# EAGLE design czbd-rc-v0.11 - bk (EAGLE 6.6.0)
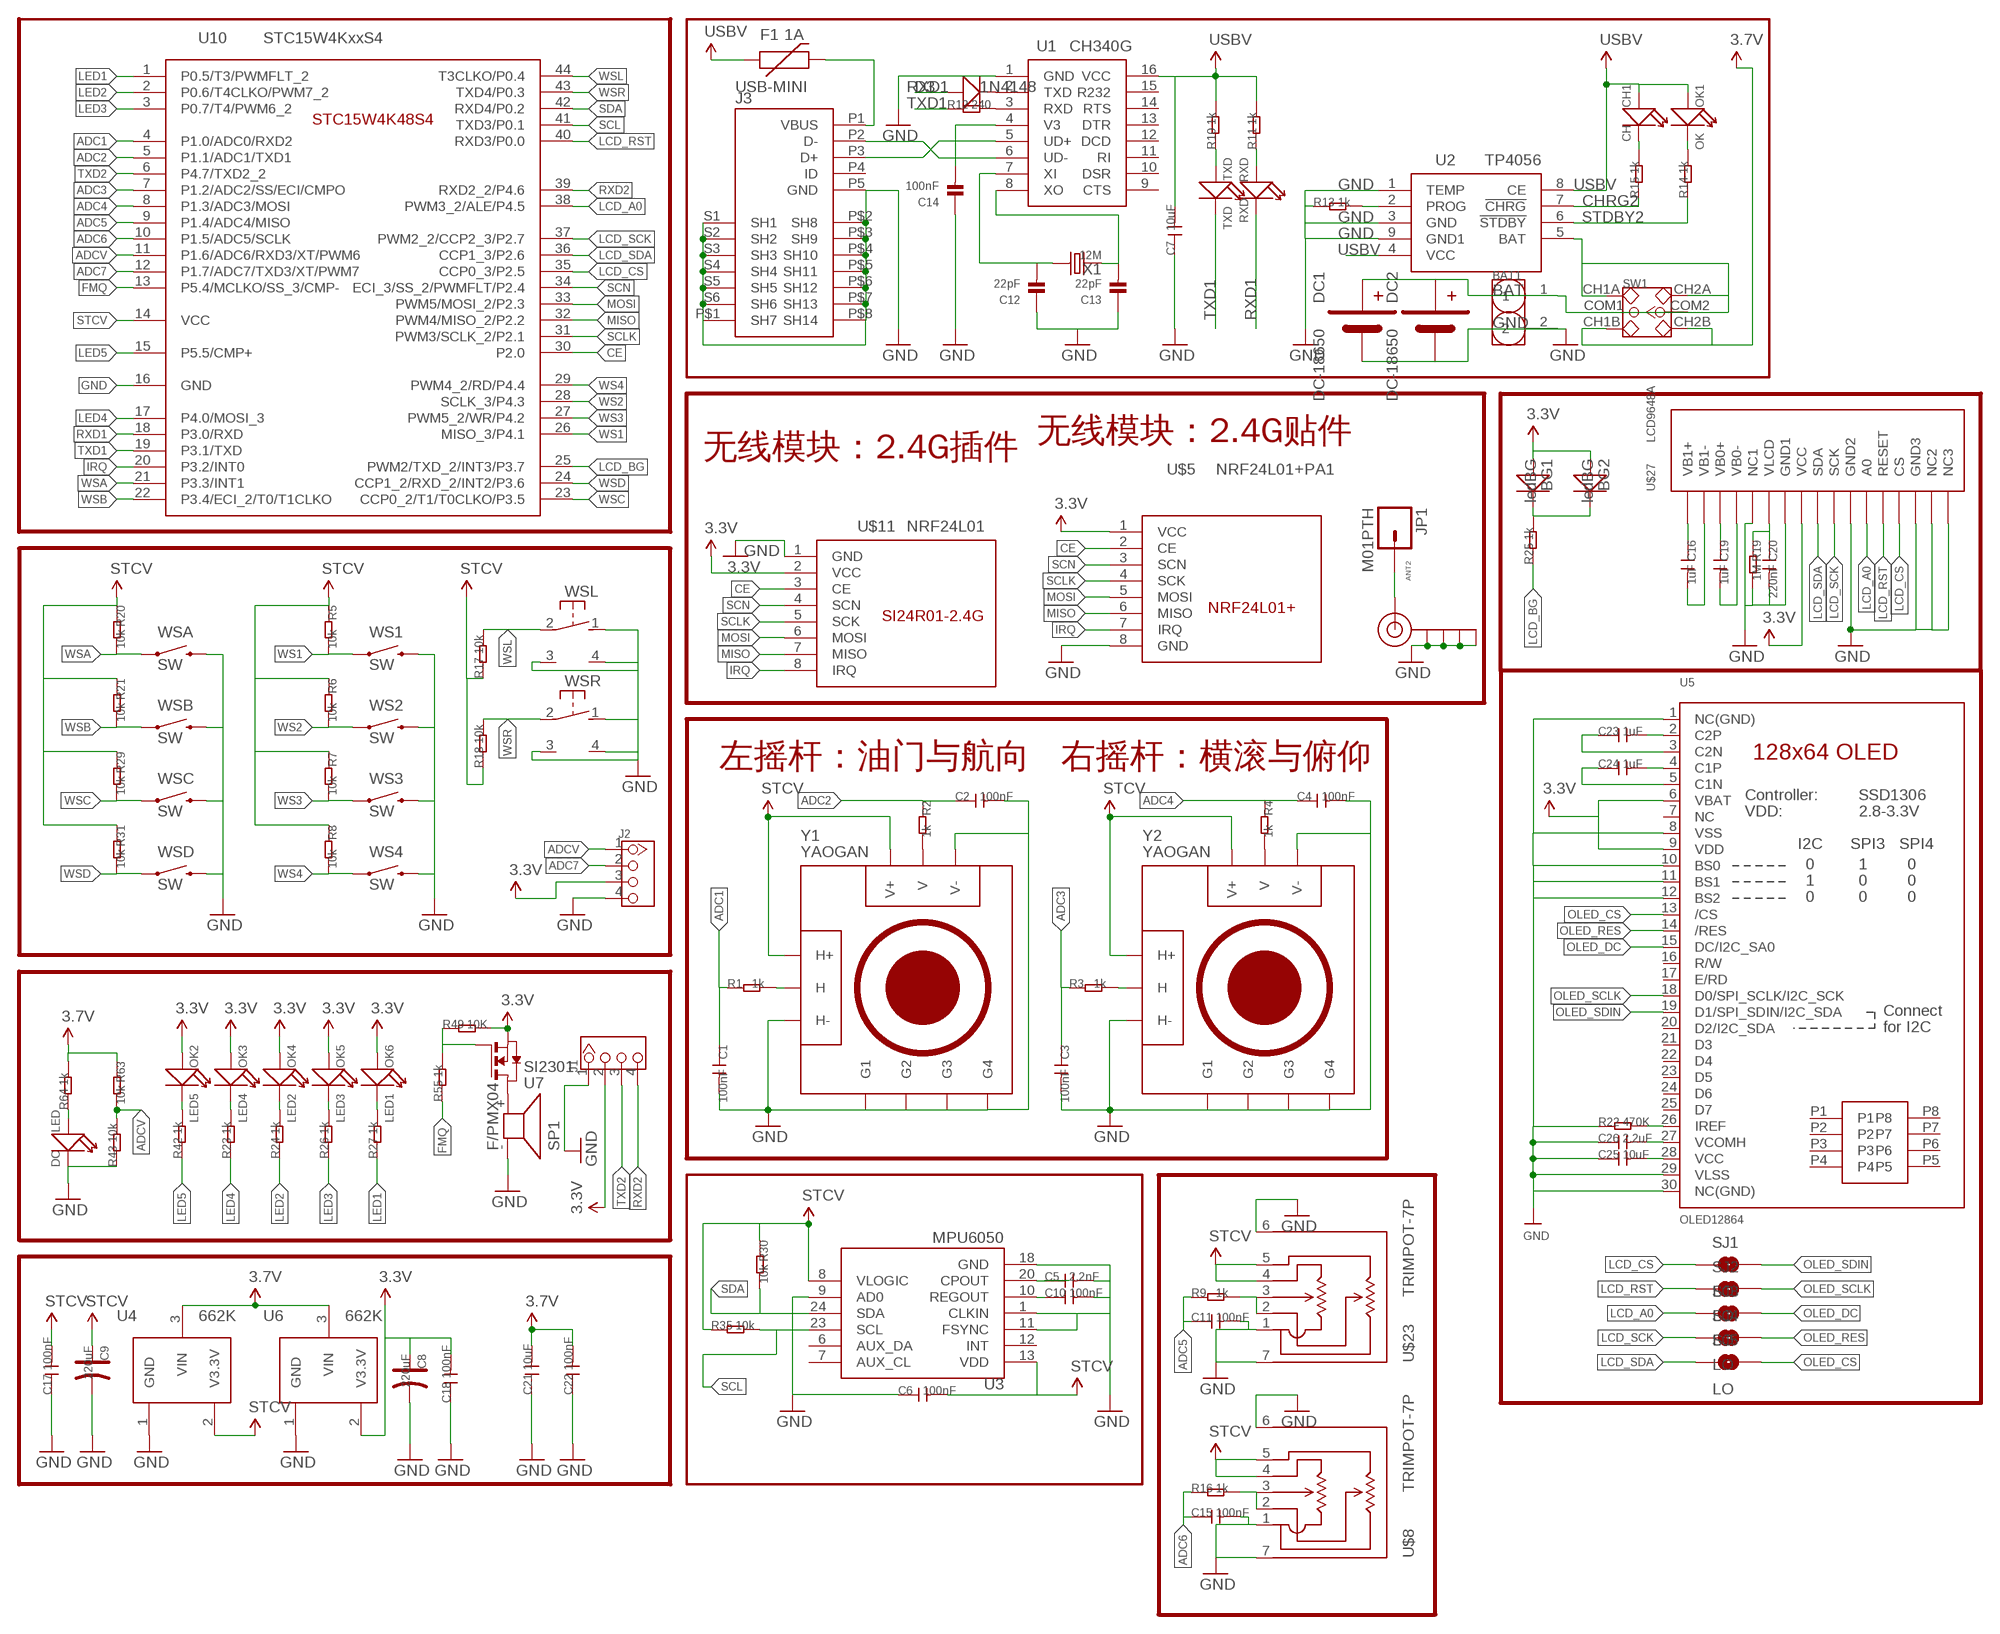
[diagram p0: schematic, sheet 1]

## Parts
ANT2  ANTENNA-SMA-EDGE  [3P-SMA-EDGE]
BAT1  HEADER-2P-2.54  [2P-2.54-DIP]
BG1  ledBG  D-1206  [D1206]
BG2  ledBG  D-1206  [D1206]
C1  100nF  DISCRETE_C-0603  [DISCRETE_C0603]
C2  100nF  DISCRETE_C-0603  [DISCRETE_C0603]
C3  100nF  DISCRETE_C-0603  [DISCRETE_C0603]
C4  100nF  DISCRETE_C-0603  [DISCRETE_C0603]
C5  2.2nF  DISCRETE_C-0603  [DISCRETE_C0603]
C6  100nF  DISCRETE_C-0603  [DISCRETE_C0603]
C7  10uF  DISCRETE_C-0805  [DISCRETE_C0805]
C8  220uF  CAP-D5.3/2.0  [ELECTRO-5.3MM]
C9  220uF  CAP-D5.3/2.0  [ELECTRO-5.3MM]
C10  100nF  DISCRETE_C-0603  [DISCRETE_C0603]
C11  100nF  DISCRETE_C-0603  [DISCRETE_C0603]
C12  22pF  CAP_CERAMIC0603  [0603]
C13  22pF  CAP_CERAMIC0603  [0603]
C14  100nF  CAP_CERAMIC0603  [0603]
C15  100nF  DISCRETE_C-0603  [DISCRETE_C0603]
C16  1uF  DISCRETE_C-0603  [DISCRETE_C0603]
C17  100nF  DISCRETE_C-0603  [DISCRETE_C0603]
C18  100nF  DISCRETE_C-0603  [DISCRETE_C0603]
C19  1uF  DISCRETE_C-0603  [DISCRETE_C0603]
C20  220nF  DISCRETE_C-0603  [DISCRETE_C0603]
C21  10uF  DISCRETE_C-0805  [DISCRETE_C0805]
C22  100nF  DISCRETE_C-0603  [DISCRETE_C0603]
C23  1uF  DISCRETE_C-0603  [DISCRETE_C0603]
C24  1uF  DISCRETE_C-0603  [DISCRETE_C0603]
C25  10uF  DISCRETE_C-0603  [DISCRETE_C0603]
C26  2.2uF  DISCRETE_C-0603  [DISCRETE_C0603]
CH1  CH  LED-0805  [D0805]
D3  1N4148  DISCRETE_D0805  [DISCRETE_SOD323]
DC1  DC-18650  DC18650B  [DC18650B]
DC2  DC-18650  DC18650B  [DC18650B]
F1  1A  PTCSMD  [PTC-1206]
J1  HEADER-4P-2.54  [4P-2.54-DIP]
J2  HEADER-4P-2.54  [4P-2.54-DIP]
J3  USB-MINI  [USB_MICRO]
JP1  M01PTH  [1X01]
LED  DC  LED-0805  [D0805]
OK1  OK  LED-0805  [D0805]
OK2  LED5  LED-0805  [D0805]
OK3  LED4  LED-0805  [D0805]
OK4  LED2  LED-0805  [D0805]
OK5  LED3  LED-0805  [D0805]
OK6  LED1  LED-0805  [D0805]
R1  1k  DISCRETE_R-0603  [DISCRETE_R0603]
R2  1k  DISCRETE_R-0603  [DISCRETE_R0603]
R3  1k  DISCRETE_R-0603  [DISCRETE_R0603]
R4  1k  DISCRETE_R-0603  [DISCRETE_R0603]
R5  10k  DISCRETE_R-0603  [DISCRETE_R0603]
R6  10k  DISCRETE_R-0603  [DISCRETE_R0603]
R7  10k  DISCRETE_R-0603  [DISCRETE_R0603]
R8  10k  DISCRETE_R-0603  [DISCRETE_R0603]
R9  1k  DISCRETE_R-0603  [DISCRETE_R0603]
R10  1k  R-0603  [R0603]
R11  1k  R-0603  [R0603]
R12  240  R-0603  [R0603]
R13  1k  R-0603  [R0603]
R14  1k  R-0603  [R0603]
R15  1k  R-0603  [R0603]
R16  1k  DISCRETE_R-0603  [DISCRETE_R0603]
R17  10k  DISCRETE_R-0603  [DISCRETE_R0603]
R18  10k  DISCRETE_R-0603  [DISCRETE_R0603]
R19  1M  DISCRETE_R-0603  [DISCRETE_R0603]
R20  10k  DISCRETE_R-0603  [DISCRETE_R0603]
R21  10k  DISCRETE_R-0603  [DISCRETE_R0603]
R22  470K  DISCRETE_R-0603  [DISCRETE_R0603]
R23  1k  R-0603  [R0603]
R24  1k  R-0603  [R0603]
R25  1k  R-0603  [R0603]
R26  1k  R-0603  [R0603]
R27  1k  R-0603  [R0603]
R29  10k  DISCRETE_R-0603  [DISCRETE_R0603]
R30  10k  DISCRETE_R-0603  [DISCRETE_R0603]
R31  10k  DISCRETE_R-0603  [DISCRETE_R0603]
R35  10k  DISCRETE_R-0603  [DISCRETE_R0603]
R42  1k  R-0603  [R0603]
R43  10k  R-0603  [R0603]
R49  10K  R-0603  [R0603]
R55  1k  R-0603  [R0603]
R63  10k  R-0603  [R0603]
R64  1k  R-0603  [R0603]
RXD  RXD  LED-0805  [D0805]
SJ1  LO  SPARKFUN_SOLDERJUMPERTRACE  [SPARKFUN_SJ_2S-TRACE]
SJ2  LO  SPARKFUN_SOLDERJUMPERTRACE  [SPARKFUN_SJ_2S-TRACE]
SJ3  LO  SPARKFUN_SOLDERJUMPERTRACE  [SPARKFUN_SJ_2S-TRACE]
SJ4  LO  SPARKFUN_SOLDERJUMPERTRACE  [SPARKFUN_SJ_2S-TRACE]
SJ5  LO  SPARKFUN_SOLDERJUMPERTRACE  [SPARKFUN_SJ_2S-TRACE]
SP1  F/PMX04  [F/PMX04A]
SW1  SEEEDSTUDIO-DISCRETE.RPT_SWITCH-2CH-6P  [SEEEDSTUDIO-DISCRETE.RPT_6P-2CH-2.54-7.6X3.0]
TXD  TXD  LED-0805  [D0805]
U1  CH340G  CH340GSO  [SO16]
U2  TP4056  [SOP8+1]
U3  MPU6050  TESTING_MPU-6050-1  [TESTING_QFN-24-4MM2]
U4  662K  XC6206P332MR662K  [SOT23-3]
U5  OLED12864  DISP_OLED_UG-2864HSWEG010.96"  [UG-2864HSWEG01_0.96IN_WRAPAROUND]
U6  662K  XC6206P332MR662K  [SOT23-3]
U7  SI2301  ARDUINO-QXZ_SI2302  [ARDUINO-QXZ_SI2301]
U8  OLED-TK  [OLED-0.96C-TK]
U10  STC15W4KxxS4  STC15W4K48S4-44P  [LQFP44]
U$5  NRF24L01+PA1  [NRF24L01+PA-C]
U$8  TRIMPOT-7P  [TO-5P]
U$11  NRF24L01  SI24R011  [SI24R01-B]
U$23  TRIMPOT-7P  [TO-5P]
U$27  LCD9648A  [LCD96X48]
WS1  SW  SWITCH-2P-SMD-1101NE  [TACTILE-SWITCH-1101NE]
WS2  SW  SWITCH-2P-SMD-1101NE  [TACTILE-SWITCH-1101NE]
WS3  SW  SWITCH-2P-SMD-1101NE  [TACTILE-SWITCH-1101NE]
WS4  SW  SWITCH-2P-SMD-1101NE  [TACTILE-SWITCH-1101NE]
WSA  SW  SWITCH-2P-SMD-1101NE  [TACTILE-SWITCH-1101NE]
WSB  SW  SWITCH-2P-SMD-1101NE  [TACTILE-SWITCH-1101NE]
WSC  SW  SWITCH-2P-SMD-1101NE  [TACTILE-SWITCH-1101NE]
WSD  SW  SWITCH-2P-SMD-1101NE  [TACTILE-SWITCH-1101NE]
WSL  SWITCH-4PS  [B3F-31XX]
WSR  SWITCH-4PS  [B3F-31XX]
X1  12M  CRYSTAL-TC26H  [TC26H]
Y1  YAOGAN  [YAOGAN5K]
Y2  YAOGAN  [YAOGAN5K]

## Nets
3.3V: BG1.+ BG2.+ C8.+ C18.2 J1.2 J2.3 OK2.+ OK3.+ OK4.+ OK5.+ OK6.+ R49.2 U5.6(VBAT) U5.9(VDD) U6.2(V3.3V) U7.2(S) U$5.1(VCC) U$11.2(VCC) U$27.P8(VCC)
3.7V: C21.2 C22.2 R63.1 R64.2 SW1.CH1B SW1.CH2B U4.3(VIN) U6.3(VIN)
ADC1: C1.1 R1.1 U10.4(P1.0/ADC0/RXD2)
ADC2: C2.1 R2.1 U10.5(P1.1/ADC1/TXD1)
ADC3: C3.1 R3.1 U10.7(P1.2/ADC2/SS/ECI/CMPO)
ADC4: C4.1 R4.1 U10.8(P1.3/ADC3/MOSI)
ADC5: C11.1 R9.1 U10.9(P1.4/ADC4/MISO)
ADC6: C15.1 R16.1 U10.10(P1.5/ADC5/SCLK)
ADC7: J2.2 U10.12(P1.7/ADC7/TXD3/XT/PWM7)
ADCV: J2.1 R43.2 R63.2 U10.11(P1.6/ADC6/RXD3/XT/PWM6)
BAT: BAT1.1 DC1.+ DC2.+ SW1.CH1A SW1.CH2A SW1.COM1 SW1.COM2 U2.5(BAT)
CE: U10.30(P2.0) U$5.2(CE) U$11.3(CE)
CHRG2: R15.1 U2.7(!CHRG)
FMQ: R55.1 U10.13(P5.4/MCLKO/SS_3/CMP-)
GND: ANT2.GND@0(GND) ANT2.GND@1(GND) ANT2.GND@2(GND) ANT2.GND@3(GND) BAT1.2 C1.2 C2.2 C3.2 C4.2 C5.2 C6.1 C7.1 C8.- C9.- C10.2 C11.2 C12.1 C13.1 C14.1 C15.2 C17.1 C18.1 C20.2 C21.1 C22.1 C25.1 C26.1 DC1.- DC2.- J1.1 J2.4 J3.P5(GND) J3.P$1(SH7) J3.P$2(SH8) J3.P$3(SH9) J3.P$4(SH10) J3.P$5(SH11) J3.P$6(SH12) J3.P$7(SH13) J3.P$8(SH14) J3.S1(SH1) J3.S2(SH2) J3.S3(SH3) J3.S4(SH4) J3.S5(SH5) J3.S6(SH6) LED.- R13.1 R19.2 R22.1 R43.1 SP1.- U1.1(GND) U2.1(TEMP) U2.3(GND) U2.9(GND1) U3.1(CLKIN) U3.9(AD0) U3.11(FSYNC) U3.18(GND) U4.1(GND) U5.1(NC(GND)) U5.8(VSS) U5.10(BS0) U5.11(BS1) U5.12(BS2) U5.29(VLSS) U5.30(NC(GND)) U6.1(GND) U10.16(GND) U$5.8(GND) U$8.1(L) U$8.6(G1) U$8.7(G2) U$11.1(GND) U$23.1(L) U$23.6(G1) U$23.7(G2) U$27.P5(NC1) U$27.P7(GND1) U$27.P11(GND2) U$27.P15(GND3) U$27.P16(NC2) U$27.P17(NC3) WS1.P$2 WS2.P$2 WS3.P$2 WS4.P$2 WSA.P$2 WSB.P$2 WSC.P$2 WSD.P$2 WSL.1(S) WSL.3(G2) WSL.4(G1) WSR.1(S) WSR.3(G2) WSR.4(G1) Y1.H3(H-) Y1.MOUNT1(G1) Y1.MOUNT2(G2) Y1.MOUNT3(G3) Y1.MOUNT4(G4) Y1.V3(V-) Y2.H3(H-) Y2.MOUNT1(G1) Y2.MOUNT2(G2) Y2.MOUNT3(G3) Y2.MOUNT4(G4) Y2.V3(V-)
IRQ: U10.20(P3.2/INT0) U$5.7(IRQ) U$11.8(IRQ)
LCD_A0: SJ3.1 U10.38(PWM3_2/ALE/P4.5) U$27.P12(A0)
LCD_BG: R25.1 U10.25(PWM2/TXD_2/INT3/P3.7)
LCD_CS: SJ1.1 U10.35(CCP0_3/P2.5) U$27.P14(CS)
LCD_RST: SJ2.1 U10.40(RXD3/P0.0) U$27.P13(RESET)
LCD_SCK: SJ4.1 U10.37(PWM2_2/CCP2_3/P2.7) U$27.P10(SCK)
LCD_SDA: SJ5.1 U10.36(CCP1_3/P2.6) U$27.P9(SDA)
LED1: R27.1 U10.1(P0.5/T3/PWMFLT_2)
LED2: R24.1 U10.2(P0.6/T4CLKO/PWM7_2)
LED3: R26.1 U10.3(P0.7/T4/PWM6_2)
LED4: R23.1 U10.17(P4.0/MOSI_3)
LED5: R42.1 U10.15(P5.5/CMP+)
MISO: U10.32(PWM4/MISO_2/P2.2) U$5.6(MISO) U$11.7(MISO)
MOSI: U10.33(PWM5/MOSI_2/P2.3) U$5.5(MOSI) U$11.6(MOSI)
N$1: R1.2 Y1.H2(H)
N$2: R3.2 Y2.H2(H)
N$3: R4.2 Y2.V2(V)
N$4: R2.2 Y1.V2(V)
N$5: R9.2 U$23.2(W2) U$23.3(W1)
N$6: R16.2 U$8.2(W2) U$8.3(W1)
N$7: C16.1 U$27.P1(VB1+)
N$8: C16.2 U$27.P2(VB1-)
N$9: C19.1 U$27.P3(VB0+)
N$10: C19.2 U$27.P4(VB0-)
N$11: C20.1 R19.1 U$27.P6(VLCD)
N$12: OK3.- R23.2
N$13: OK4.- R24.2
N$14: R22.2 U5.26(IREF)
N$15: CH1.- R15.2
N$16: C10.1 U3.10(REGOUT)
N$17: C5.1 U3.20(CPOUT)
N$18: C23.2 U5.2(C2P)
N$19: C23.1 U5.3(C2N)
N$20: OK6.- R27.2
N$21: ANT2.SIG(SIGNAL) JP1.1
N$22: R13.2 U2.2(PROG)
N$23: SP1.+ U7.1(D)
N$24: C24.2 U5.4(C1P)
N$25: C24.1 U5.5(C1N)
N$26: OK2.- R42.2
N$27: C25.2 U5.28(VCC)
N$28: D3.- U1.2(TXD)
N$29: C26.2 U5.27(VCOMH)
N$30: BG1.- BG2.- R25.2
N$31: OK5.- R26.2
N$38: R10.1 TXD.+
N$39: R49.1 R55.2 U7.3(G)
N$41: R11.1 RXD.+
N$42: C13.2 U1.8(XO) X1.1
N$43: C12.2 U1.7(XI) X1.2
N$47: F1.2 J3.P1(VBUS)
N$48: C14.2 U1.4(V3)
N$53: R12.2 U1.3(RXD)
N$54: J3.P2(D-) U1.6(UD-)
N$55: J3.P3(D+) U1.5(UD+)
N$65: LED.+ R64.1
N$321: OK1.- R14.2
OLED_CS: SJ5.2 U5.13(/CS)
OLED_DC: SJ3.2 U5.15(DC/I2C_SA0)
OLED_RES: SJ4.2 U5.14(/RES)
OLED_SCLK: SJ2.2 U5.18(D0/SPI_SCLK/I2C_SCK)
OLED_SDIN: SJ1.2 U5.19(D1/SPI_SDIN/I2C_SDA)
RXD1: D3.+ RXD.- U10.18(P3.0/RXD)
RXD2: J1.4 U10.39(RXD2_2/P4.6)
SCL: R35.2 U3.23(SCL) U10.41(TXD3/P0.1)
SCLK: U10.31(PWM3/SCLK_2/P2.1) U$5.4(SCK) U$11.5(SCK)
SCN: U10.34(ECI_3/SS_2/PWMFLT/P2.4) U$5.3(SCN) U$11.4(SCN)
SDA: R30.2 U3.24(SDA) U10.42(RXD4/P0.2)
STCV: C6.2 C9.+ C17.2 R5.1 R6.1 R7.1 R8.1 R17.1 R18.1 R20.1 R21.1 R29.1 R30.1 R31.1 R35.1 U3.8(VLOGIC) U3.13(VDD) U4.2(V3.3V) U10.14(VCC) U$8.4(H1) U$8.5(H2) U$23.4(H1) U$23.5(H2) Y1.H1(H+) Y1.V1(V+) Y2.H1(H+) Y2.V1(V+)
STDBY2: R14.1 U2.6(!STDBY)
TXD1: R12.1 TXD.- U10.19(P3.1/TXD)
TXD2: J1.3 U10.6(P4.7/TXD2_2)
USBV: C7.2 CH1.+ F1.1 OK1.+ R10.2 R11.2 U1.16(VCC) U2.4(VCC) U2.8(CE)
WS1: R5.2 U10.26(MISO_3/P4.1) WS1.P$1
WS2: R6.2 U10.28(SCLK_3/P4.3) WS2.P$1
WS3: R7.2 U10.27(PWM5_2/WR/P4.2) WS3.P$1
WS4: R8.2 U10.29(PWM4_2/RD/P4.4) WS4.P$1
WSA: R20.2 U10.21(P3.3/INT1) WSA.P$1
WSB: R21.2 U10.22(P3.4/ECI_2/T0/T1CLKO) WSB.P$1
WSC: R29.2 U10.23(CCP0_2/T1/T0CLKO/P3.5) WSC.P$1
WSD: R31.2 U10.24(CCP1_2/RXD_2/INT2/P3.6) WSD.P$1
WSL: R17.2 U10.44(T3CLKO/P0.4) WSL.2(P)
WSR: R18.2 U10.43(TXD4/P0.3) WSR.2(P)
Unconnected: J3.P4(ID) U1.9(CTS) U1.10(DSR) U1.11(RI) U1.12(DCD) U1.13(DTR) U1.14(RTS) U1.15(R232) U3.6(AUX_DA) U3.7(AUX_CL) U3.12(INT) U5.7(NC) U5.16(R/W) U5.17(E/RD) U5.20(D2/I2C_SDA) U5.21(D3) U5.22(D4) U5.23(D5) U5.24(D6) U5.25(D7) U8.P1 U8.P2 U8.P3 U8.P4 U8.P5 U8.P6 U8.P7 U8.P8

## Notes on the sheet
- 无线模块：2.4G贴件
- 无线模块：2.4G插件
- 左摇杆：油门与航向 | 右摇杆：横滚与俯仰

## Library data of the parts
ANT2 = SeeedStudio-Connector:ANTENNA-SMA-EDGE: SMA Antenna Connector End launch SMA connector. The paste layer has been removed so that the connector can be hand soldered onto the board after reflow.
BAT1 = SeeedStudio-Connector:HEADER-2P
BG1 BG2 = Seeedstudio-Discrete.rpt:D*
C1-C7 C10 C11 C15-C26 = mazebot:DISCRETE_C*: Ceramic Capacitors
C8 C9 = Seeedstudio-Discrete.rpt:CAP*: Electrolytic Capacitors,Tantalum Capacitors and Super Capacitors
C12-C14 = microbuilder:CAP_CERAMIC: Ceramic Capacitors 0402 - 0402 Surface Mount Capacitors 16pF 50V 5% [Digikey: 445-4899-2-ND] 18pF 50V 5% [Digikey: 490-1281-2-ND] 22pF 50V 5% [Digikey: 490-1283-2-ND] 68pF 50V 5% [Digikey: 490-1289-2-ND] 0.1uF 10V 10% [Digikey: 490-1318-2-ND] 1.0uF 6.3V 10% [Digikey: 490-1320-2-ND] 0603 - 0603 Surface Mount Capacitors 16 pF 50V 5% [Digikey: 445-5051-2-ND] 22 pF 50V [Digikey: PCC220ACVTR-ND] 33 pF 50V 5% [Digikey: 490-1415-1-ND] 56pF 50V 5% [Digikey: 490-1421-1-ND] 220pF 50V 5% [Digikey: 445-1285-1-ND] 680 pF 50V 2200 pF 50V 5% C0G [Digikey: 445-1297-1-ND] 5600 pF 100V 5% X7R [Digikey: 478-3711-1-ND] 0.1 µF 25V 10% [Digikey: PCC2277TR-ND] 0.22 µF 16V 10% X7R [Digikey: 445-1318-1-ND] 1.0 µF 25V 10% [Digikey: 445-5146-2-ND] 0603 - RF Specific 3pF 250V +/-0.1pF RF [Digikey: 712-1347-1-ND] 18 pF 250V 5% [Digikey: 478-3505-1-ND or 712-1322-1-ND] 56 pF 250V 5% C0G RF [Digikey: 490-4867-1-ND] 68 pF 250V RF [Digikey: 490-4868-1-ND] 0805 - 0805 Surface Mount Capacitors 220 pF 250V 2% RF Ceramic Capacitor [Digikey: 712-1398-1-ND] 1000 pF 50V 2% NP0 Ceramic Capacitor [Digikey: 478-3760-1-ND] 0.1 µF 25V 10% Ceramic Capacitor [Digikey: PCC1828TR-ND] 1.0 µF 16V 10% Ceramic Capacitor[Digikey: 490-1691-2-ND] 10.0 µF 10V 10% Ceramic Capacitor[Digikey: 709-1228-1-ND] 10.0 uF 16V 10% Ceramic Capacitor [Digikey: 478-5165-2-ND] 47 uF 6.3V 20% Ceramic Capacitor [Digikey: 587-1779-1-ND or 399-5506-1-ND] 1206 - 1206 Surface Mount Capacitors 47uF 10V 20% Ceramic Capacitor [Digikey: 490-5528-1-ND or 399-5508-1-ND or 445-6010-1-ND] 100uF 6.3V -20%, +80% Y5V Ceramic Capacitor (Digikey: 490-4512-1-ND, Mouser: 81-GRM31CF50J107ZE1L)
CH1 LED OK1-OK6 RXD TXD = Discrete:LED*
D3 = mazebot:DISCRETE_D*
DC1 DC2 = QXZ:DC18650
F1 = SparkFun-PowerIC:PTC: Resettable Fuse PTC Resettable Fuse. Spark Fun Electronics SKU : COM-08357
J1 J2 = SeeedStudio-Connector:HEADER-4P
J3 = QXZ:USB-MINI
JP1 = QXZ:M01: Header 1 Standard 1-pin 0.1" header. Use with straight break away headers (SKU : PRT-00116), right angle break away headers (PRT-00553), swiss pins (PRT-00743), machine pins (PRT-00117), and female headers (PRT-00115).
R1-R9 R16-R22 R29-R31 R35 = mazebot:DISCRETE_R*
R10-R15 R23-R27 R42 R43 R49 R55 R63 R64 = Discrete:R*
SJ1-SJ5 = mazebot:SPARKFUN_SOLDERJUMPER: Solder Jumper Standard SMD solder jumper. Used to automate production. Two varients : Normally Open and Normally Closed are the same, but have different paste layers. NC will have a large amount of paste and should jumper during reflow.
SP1 = arduino-QXZ:F/PMX04: SPEAKER Source: Buerklin; OC_FARNELL: unknown; OC_NEWARK: unknown
SW1 = mazebot:SEEEDSTUDIO-DISCRETE.RPT_SWITCH-2CH-6P
U1 = QXZ:CH340G
U2 = QXZ:TP4056
U3 = MPU6050:TESTING_MPU-6050
U4 U6 = QXZ:XC6206P332MR
U5 = microbuilder:DISP_OLED_UG-2864HSWEG01: UG-2864HSWEG01 OLED display Both 1.3" and 0.96" models share the same FPC tab footprint, only the screen dimensions vary.
U7 = mazebot:ARDUINO-QXZ_SI2302
U8 = duinofun-outline:OLED-TK
U10 = QXZ:STC15W4K48S4-44P
U$5 = QXZ:NRF24L01+
U$8 U$23 = QXZ:TRIMPOT-7P
U$11 = QXZ:SI24R01
U$27 = QXZ:LCD9648
WS1-WS4 WSA WSB WSC WSD = QXZ:SWITCH-2P
WSL WSR = QXZ:SWITCH-4PS: OMRON SWITCH Now with beefier pads!
X1 = Seeedstudio-Discrete.rpt:CRYSTAL*: CRYSTAL
Y1 Y2 = QXZ:YAOGAN

## Net classes
0 default: width 0.203 mm, drill 0.305 mm, clearance 0.203 mm

## Board
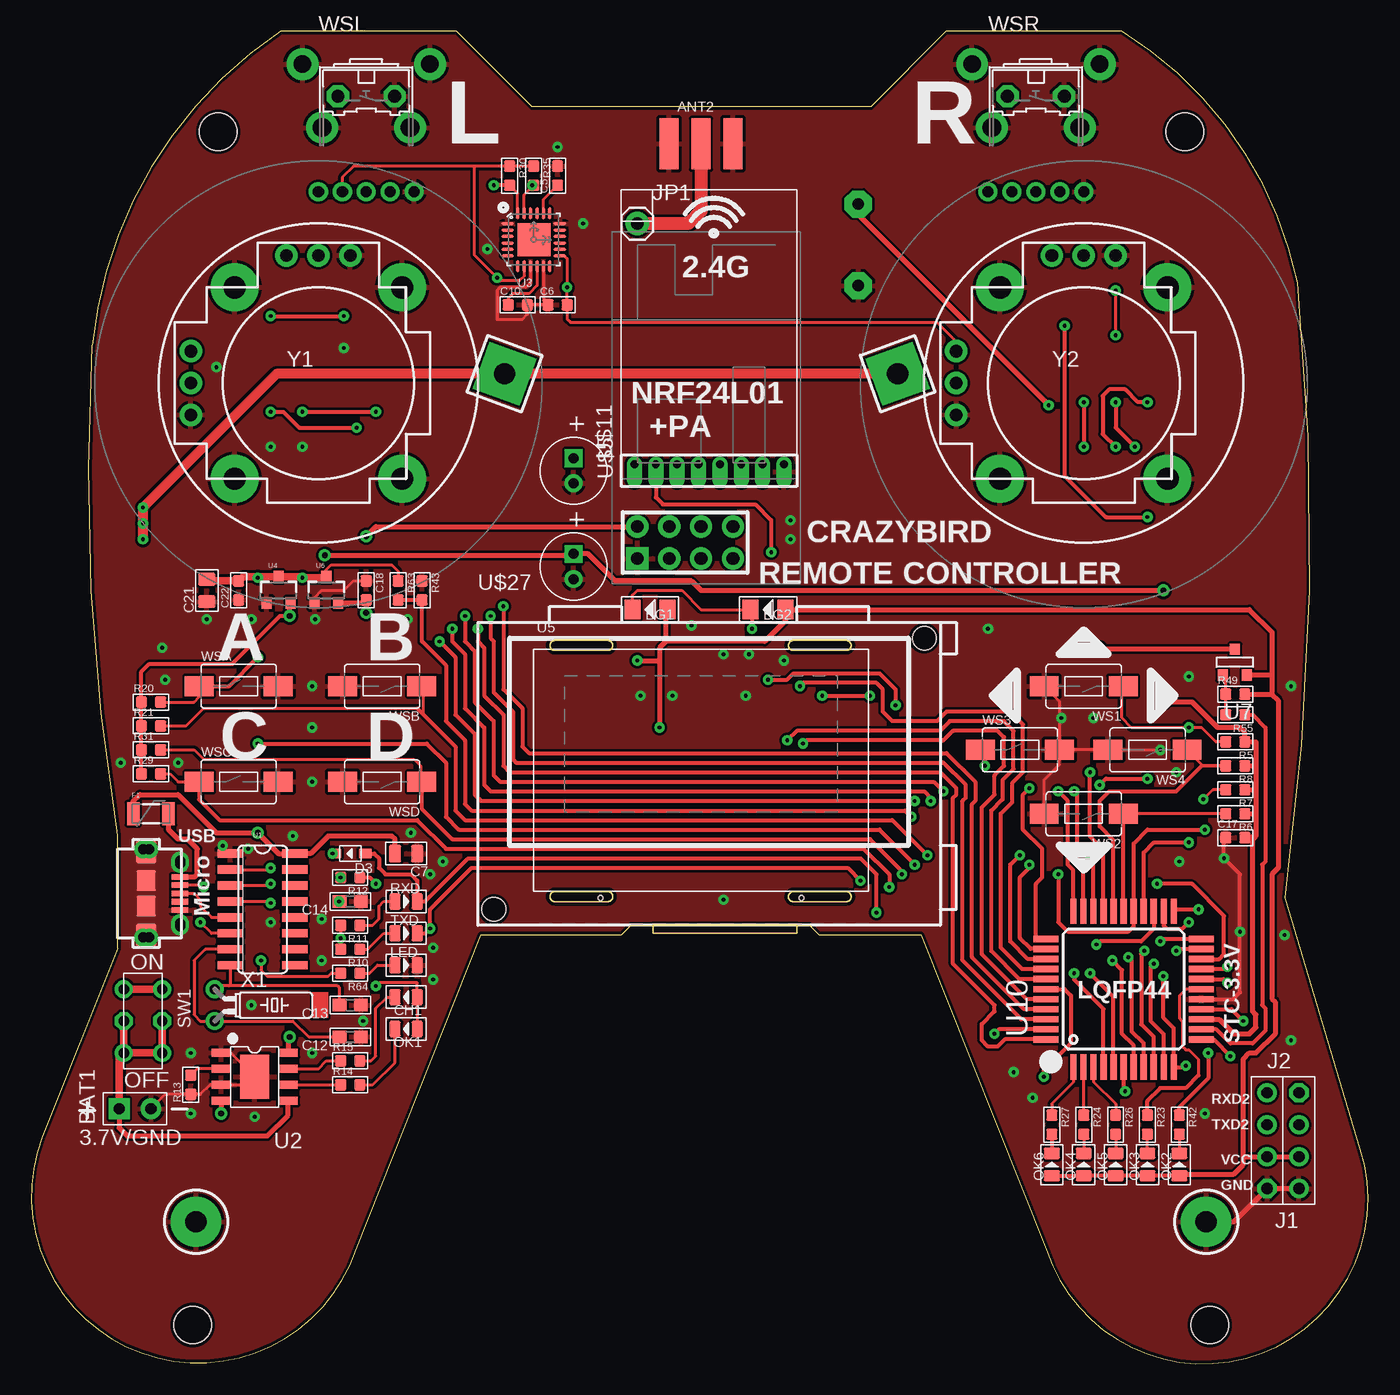
[diagram p1: board, top side]
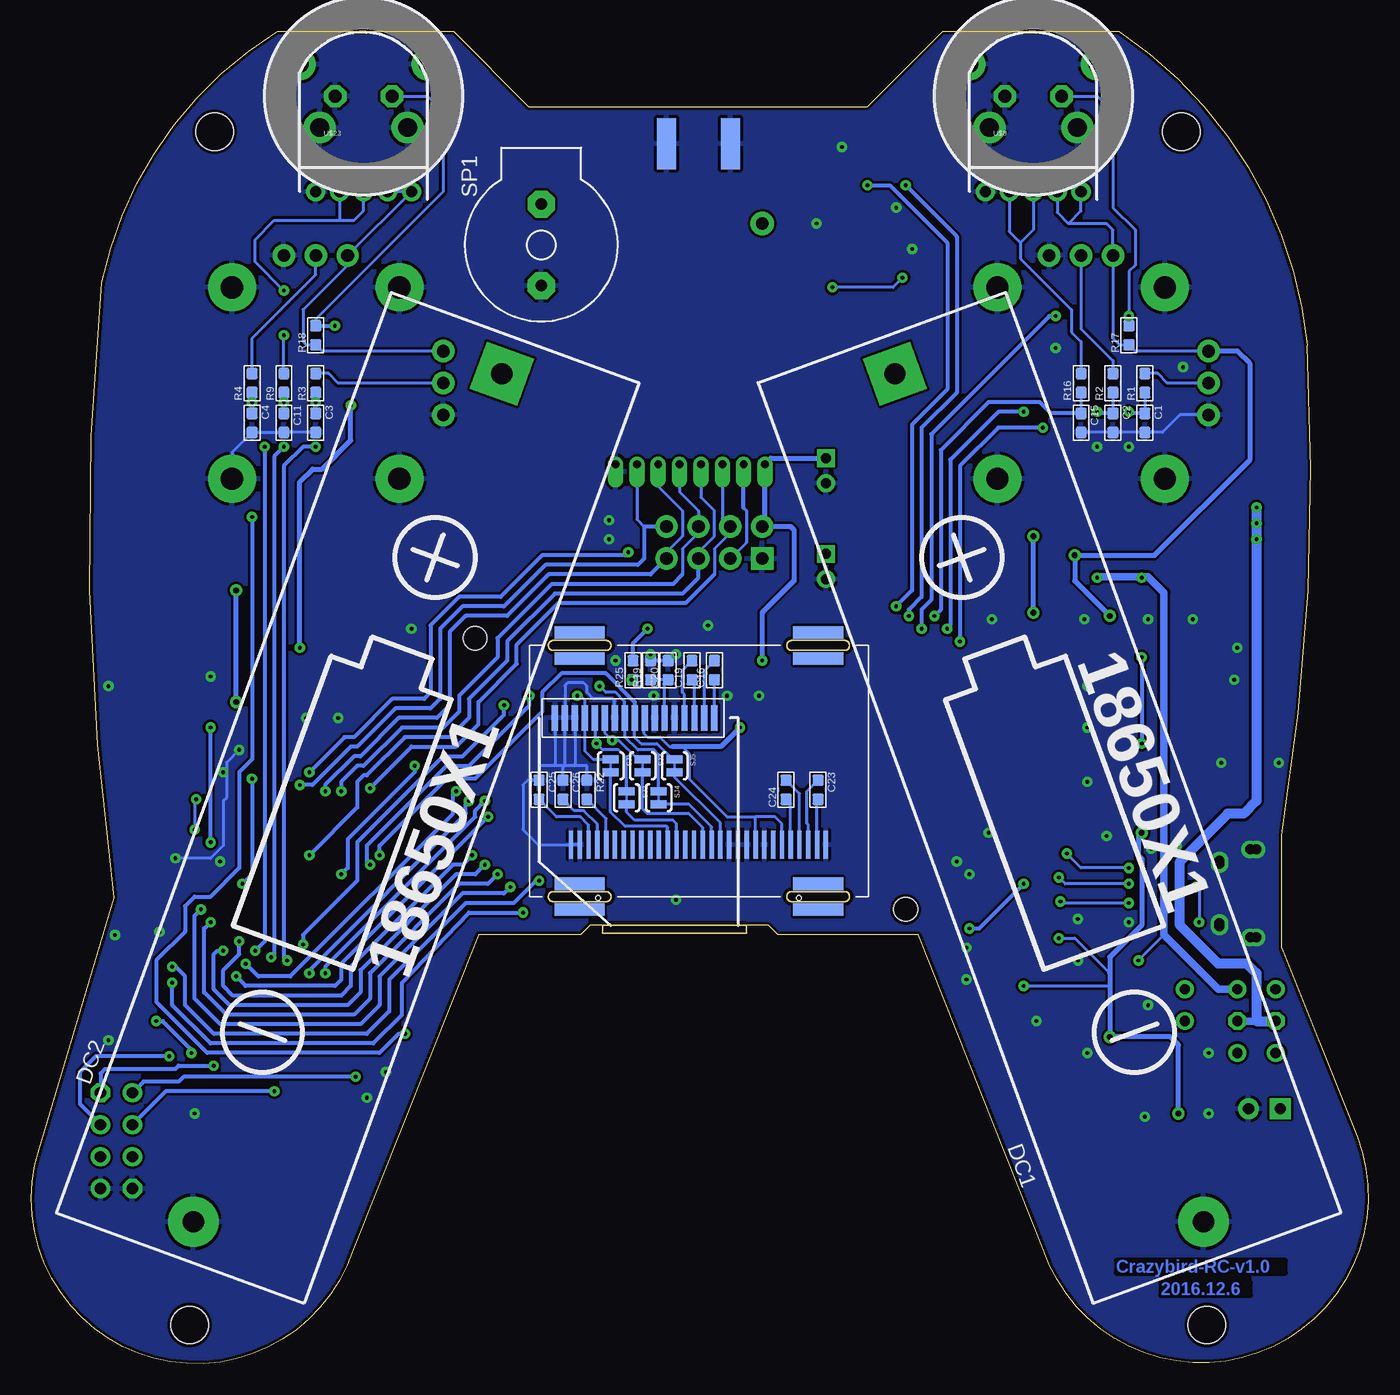
[diagram p2: board, bottom side, seen from below]

Size 106.47 x 106.07 mm. Coordinates in mm from the lower left corner, seen from the top.
Outline: 19.86,106.07 arc51 4.86,81.07 arc13 6.86,42.07 6.86,33.07 0.86,18.07 arc182 25.86,9.07 35.82,34.13 46.99,34.13 47.75,34.89 61.98,34.89 62.74,34.13 70.87,34.13 80.86,9.07 arc180 105.86,17.07 99.86,37.07 arc14 100.86,86.07 arc46 86.86,106.07 72.86,106.07 66.86,100.07 39.86,100.07 33.86,106.07 19.86,106.07
Copper layers (1*16): Top 0.035mm / dielectric 1.5mm / Bottom 0.035mm
Design rules "Sparkfun": minimum track width 8mil, minimum drill 20mil, track to track 8mil, track to pad 8mil, pad to pad 8mil, via to via 8mil, smd to smd 8mil, copper to edge 10mil, drill to drill 8mil, minimum pad ring 12mil, minimum via ring 10mil, stop-mask expansion 4mil, vias tented up to drill 25mil, thermal gap 10mil
Holes 3 mm at 14.86,98.07 91.86,98.07 93.86,3.07 12.86,3.07

### Footprints (pad centres in the part's own frame; a part is rotated, then mirrored left to right if it is on the bottom)
3P-SMA-EDGE = smd 1.524 x 4.064: GND@0 0,0; GND@1 5.08,0; SIG 2.54,0 | smd 1.524 x 4.064 bottom: GND@2 0,0; GND@3 5.08,0
2P-2.54-DIP = drill 0.889 pad 1.651 square: 1 0,1.27 | drill 0.889 pad 1.651: 2 0,-1.27
D1206 = smd 1.27 x 1.524: + -1.397,0; - 1.397,0
DISCRETE_C0603 = smd 0.889 x 0.889: 1 -0.762,0; 2 0.762,0
DISCRETE_C0805 = smd 1.016 x 1.397: 1 -0.889,0; 2 0.889,0
ELECTRO-5.3MM = drill 0.8 pad 1.35 square: + -1,0 | drill 0.8 pad 1.35: - 1,0
0603 = smd 1.1 x 1: 1 -0.85,0; 2 0.85,0
D0805 = smd 0.889 x 1.27: + -0.889,0; - 0.889,0
DISCRETE_SOD323 = smd 1 x 0.8: + -1.2,0; - 1.2,0
DC18650B = drill 1.7 pad 4 square: + 35.925,0 | drill 1.7 pad 4: - -35.925,0
PTC-1206 = smd 1 x 1.8: 1 -1.4,0; 2 1.4,0
4P-2.54-DIP = drill 0.889 pad 1.524 octagon: 1 0,3.81 | drill 0.889 pad 1.524: 2 0,1.27; 3 0,-1.27; 4 0,-3.81
USB_MICRO = smd 0.406 x 1.346: P1 -1.321,2.692; P2 -0.66,2.692; P3 0,2.692; P4 0.66,2.692; P5 1.321,2.692 | drill 0.8 pad 1.27: P$1 -2.616,2.692 | drill 0.8 pad 1.245: P$2 -2.362,2.692; P$7 2.362,2.692; P$8 2.616,2.692 | drill 0.8 pad 1.143: P$3 -3.505,-0.254; P$4 -3.505,0.254; P$5 3.505,0.254; P$6 3.505,-0.254 | smd 1.778 x 1.651: S1 -3.302,0; S2 3.302,0 | smd 1.397 x 1.27: S3 -2.489,2.692; S4 2.489,2.692 | smd 1.626 x 1.524: S5 -1.016,0; S6 1.016,0
1X01 = drill 1.016 pad 1.88: 1 0,0
DISCRETE_R0603 = smd 0.889 x 0.889: 1 -0.762,0; 2 0.762,0
R0603 = smd 0.889 x 0.889: 1 -0.762,0; 2 0.762,0
SPARKFUN_SJ_2S-TRACE = smd 0.635 x 1.27: 1 -0.508,0; 2 0.508,0
F/PMX04A = drill 0.914 pad 2.159 octagon: + 3.251,0; - -3.251,0
SEEEDSTUDIO-DISCRETE.RPT_6P-2CH-2.54-7.6X3.0 = drill 0.813 pad 1.27: CH1A -1.524,2.54; CH1B -1.524,-2.54; CH2A 1.524,2.54; CH2B 1.524,-2.54 | drill 0.813 pad 1.27 octagon: COM1 -1.524,0; COM2 1.524,0
SO16 = smd 0.66 x 2.032: 1 -4.445,-2.565; 2 -3.175,-2.565; 3 -1.905,-2.565; 4 -0.635,-2.565; 5 0.635,-2.565; 6 1.905,-2.565; 7 3.175,-2.565; 8 4.445,-2.565; 9 4.445,2.565; 10 3.175,2.565; 11 1.905,2.565; 12 0.635,2.565; 13 -0.635,2.565; 14 -1.905,2.565; 15 -3.175,2.565; 16 -4.445,2.565
SOP8+1 = smd 1.524 x 0.635: 1 -2.667,1.905; 2 -2.667,0.635; 3 -2.667,-0.635; 4 -2.667,-1.905; 5 2.667,-1.905; 6 2.667,-0.635; 7 2.667,0.635; 8 2.667,1.905 | smd 2.3 x 3.5: 9 0,0
TESTING_QFN-24-4MM2 = smd 1.016 x 0.254: 1 -2.066,1.257; 2 -2.066,0.75; 3 -2.066,0.247; 4 -2.066,-0.287; 5 -2.066,-0.792; 6 -2.066,-1.297; 13 2.086,-1.297; 14 2.086,-0.792; 15 2.086,-0.287; 16 2.086,0.247; 17 2.086,0.75; 18 2.086,1.257 | smd 0.254 x 1.016: 7 -1.267,-2.122; 8 -0.762,-2.122; 9 -0.258,-2.122; 10 0.278,-2.122; 11 0.78,-2.122; 12 1.287,-2.122; 19 1.287,2.082; 20 0.78,2.082; 21 0.278,2.082; 22 -0.258,2.082; 23 -0.762,2.082; 24 -1.267,2.082 | smd 2.616 x 2.616: P$1 0.02,-0.01
SOT23-3 = smd 0.8 x 0.9: 1 -0.95,-1; 2 0.95,-1; 3 0,1.1
UG-2864HSWEG01_0.96IN_WRAPAROUND = smd 0.35 x 2.2 bottom: 1 -10.15,-1.2; 2 -9.45,-1.2; 3 -8.75,-1.2; 4 -8.05,-1.2; 5 -7.35,-1.2; 6 -6.65,-1.2; 7 -5.95,-1.2; 8 -5.25,-1.2; 9 -4.55,-1.2; 10 -3.85,-1.2; 11 -3.15,-1.2; 12 -2.45,-1.2; 13 -1.75,-1.2; 14 -1.05,-1.2; 15 -0.35,-1.2; 16 0.35,-1.2; 17 1.05,-1.2; 18 1.75,-1.2; 19 2.45,-1.2; 20 3.15,-1.2; 21 3.85,-1.2; 22 4.55,-1.2; 23 5.25,-1.2; 24 5.95,-1.2; 25 6.65,-1.2; 26 7.35,-1.2; 27 8.05,-1.2; 28 8.75,-1.2; 29 9.45,-1.2; 30 10.15,-1.2 | hole 0.4: -8,-5.45; 8,-5.45
ARDUINO-QXZ_SI2301 = smd 0.787 x 0.889: 1 -0.025,1.016; 2 0.94,-1.016; 3 -0.991,-1.016
OLED-0.96C-TK = smd 4 x 1: P1 4,-1.027; P2 4,1.027; P3 23,1.027; P4 23,-1.027; P5 4,21.027; P6 4,18.973; P7 23,21.027; P8 23,18.973
LQFP44 = smd 2 x 0.5: 1 -6.2,4; 2 -6.2,3.2; 3 -6.2,2.4; 4 -6.2,1.6; 5 -6.2,0.8; 6 -6.2,0; 7 -6.2,-0.8; 8 -6.2,-1.6; 9 -6.2,-2.4; 10 -6.2,-3.2; 11 -6.2,-4; 23 6.2,-4; 24 6.2,-3.2; 25 6.2,-2.4; 26 6.2,-1.6; 27 6.2,-0.8; 28 6.2,0; 29 6.2,0.8; 30 6.2,1.6; 31 6.2,2.4; 32 6.2,3.2; 33 6.2,4 | smd 0.5 x 2: 12 -4,-6.2; 13 -3.2,-6.2; 14 -2.4,-6.2; 15 -1.6,-6.2; 16 -0.8,-6.2; 17 0,-6.2; 18 0.8,-6.2; 19 1.6,-6.2; 20 2.4,-6.2; 21 3.2,-6.2; 22 4,-6.2; 34 4,6.2; 35 3.2,6.2; 36 2.4,6.2; 37 1.6,6.2; 38 0.8,6.2; 39 0,6.2; 40 -0.8,6.2; 41 -1.6,6.2; 42 -2.4,6.2; 43 -3.2,6.2; 44 -4,6.2
NRF24L01+PA-C = drill 0.635 offset: 1 1.168,12.929; 2 1.168,11.227; 3 1.168,9.525; 4 1.168,7.823; 5 1.168,6.121; 6 1.168,4.42; 7 1.168,2.718; 8 1.168,1.016
TO-5P = drill 0.889 pad 1.524: 1 0,0; 2 1.905,0; 3 3.81,0; 4 5.715,0; 5 7.62,0 | drill 1.397 pad 2.54: 6 -1.27,10.16; 7 8.89,10.16
SI24R01-B = drill 1.016 pad 1.778 square: 1 0,0 | drill 1.016 pad 1.778: 2 2.54,0; 3 0,-2.54; 4 2.54,-2.54; 5 0,-5.08; 6 2.54,-5.08; 7 0,-7.62; 8 2.54,-7.62
LCD96X48 = smd 0.508 x 2.032 bottom: P1 16.51,16.51; P2 17.304,16.51; P3 18.098,16.51; P4 18.891,16.51; P5 19.685,16.51; P6 20.479,16.51; P7 21.273,16.51; P8 22.066,16.51; P9 22.86,16.51; P10 23.654,16.51; P11 24.448,16.51; P12 25.241,16.51; P13 26.035,16.51; P14 26.829,16.51; P15 27.622,16.51; P16 28.416,16.51; P17 29.21,16.51 | hole 1.905: 1.27,1.27; 35.56,22.86
TACTILE-SWITCH-1101NE = smd 2.3 x 1.6: P$1 -3.15,0; P$2 3.15,0
B3F-31XX = drill 1.016 pad 1.778 octagon: 1 2.261,-0.025; 2 -2.261,-0.025 | drill 1.499 pad 2.54: 3 3.505,-2.515; 4 -3.505,-2.515
TC26H = drill 0.813: 1 -1.27,0; 2 1.27,0
YAOGAN5K = drill 1.016 pad 1.778: H1 -10.16,2.54; H2 -10.16,0; H3 -10.16,-2.54; V1 -2.54,10.16; V2 0,10.16; V3 2.54,10.16 | drill 1.778 pad 3.81: MOUNT1 6.668,7.62; MOUNT2 -6.668,7.62; MOUNT3 -6.668,-7.62; MOUNT4 6.668,-7.62

### Placement (x,y rotation side)
ANT2  50.8,97.12 0 top
BAT1  8.26,20.29 90 top
BG1  49.28,60.04 180 top
BG2  58.68,60.04 180 top
C1  17.78,74.9 270 bottom
C2  20.32,74.9 270 bottom
C3  83.82,74.9 270 bottom
C4  88.9,74.9 270 bottom
C5  41.91,94.58 90 top
C6  41.91,84.3 0 top
C7  29.85,40.61 180 top
C8  43.18,71.09 270 top
C9  43.18,63.47 270 top
C10  38.74,84.3 0 top
C11  86.36,74.9 270 bottom
C12  25.4,26 180 top
C13  25.4,28.54 180 top
C14  25.4,36.8 180 top
C15  22.86,74.9 270 bottom
C16  52.07,55.21 90 bottom
C17  95.89,41.88 0 top
C18  26.67,61.56 270 top
C19  53.85,55.21 90 bottom
C20  55.75,55.21 90 bottom
C21  13.97,61.56 90 top
C22  16.51,61.56 90 top
C23  43.82,45.69 270 bottom
C24  46.36,45.69 90 bottom
C25  66.04,45.69 270 bottom
C26  64.14,45.69 270 bottom
CH1  29.85,29.18 180 top
D3  25.4,40.61 180 top
DC1  25.4,45.05 110 bottom
DC2  81.28,45.05 70 bottom
F1  9.53,43.78 0 top
J1  98.43,17.75 180 top
J2  100.97,17.75 0 top
J3  9.15,37.43 270 top
JP1  48.26,90.77 0 top
LED  29.85,31.72 0 top
OK1  29.85,26.64 180 top
OK2  91.44,15.84 90 top
OK3  88.9,15.84 90 top
OK4  83.82,15.84 90 top
OK5  86.36,15.84 90 top
OK6  81.28,15.84 90 top
R1  17.78,78.07 90 bottom
R2  20.32,78.07 90 bottom
R3  83.82,78.07 90 bottom
R4  88.9,78.07 90 bottom
R5  95.89,49.5 180 top
R6  95.89,43.78 180 top
R7  95.89,45.69 180 top
R8  95.89,47.59 180 top
R9  86.36,78.07 90 bottom
R10  25.4,32.99 180 top
R11  25.4,34.89 180 top
R12  25.4,38.7 180 top
R13  12.7,22.19 90 top
R14  25.4,22.19 0 top
R15  25.4,24.1 0 top
R16  22.86,78.07 90 bottom
R17  19.05,81.88 90 bottom
R18  83.82,81.88 90 bottom
R19  57.15,55.21 90 bottom
R20  9.53,52.67 0 top
R21  9.53,50.77 0 top
R22  62.23,45.69 270 bottom
R23  88.9,19.02 270 top
R24  83.82,19.02 270 top
R25  58.55,55.21 90 bottom
R26  86.36,19.02 270 top
R27  81.28,19.02 270 top
R29  9.53,46.96 0 top
R30  38.1,94.58 270 top
R31  9.53,48.86 0 top
R35  40.01,94.58 270 top
R42  91.44,19.02 270 top
R43  31.12,61.56 270 top
R49  95.89,53.31 0 top
R55  95.89,51.66 180 top
R63  29.21,61.56 270 top
R64  25.4,31.08 180 top
RXD  29.85,36.8 0 top
SJ1  60.33,47.59 270 bottom
SJ2  59.06,45.05 270 bottom
SJ3  57.79,47.59 270 bottom
SJ4  56.52,45.05 270 bottom
SJ5  55.25,47.59 270 bottom
SP1  65.86,89.07 90 bottom
SW1  8.89,27.27 180 top
TXD  29.85,34.26 0 top
U1  18.42,36.16 270 top
U2  17.78,22.83 0 top
U3  40.01,89.5 0 top
U4  19.69,61.56 0 top
U5  53.34,42.51 0 top
U6  23.5,61.56 0 top
U7  95.89,55.85 0 top
U8  66.8,37.18 0 bottom
U10  87,29.81 90 top
U$5  60.96,70.45 90 top
U$8  30.48,93.31 0 bottom
U$11  48.26,64.1 90 top
U$23  83.82,93.31 0 bottom
U$27  35.56,34.89 0 top
WS1  83.82,53.94 180 top
WS2  83.82,43.78 180 top
WS3  78.74,48.86 0 top
WS4  88.9,48.86 180 top
WSA  16.51,53.94 0 top
WSB  27.94,53.94 180 top
WSC  16.51,46.32 0 top
WSD  27.94,46.32 180 top
WSL  26.67,100.93 0 top
WSR  80.01,100.93 0 top
X1  14.61,28.54 270 top
Y1  22.86,78.07 0 top
Y2  83.82,78.07 0 top

### Tracks (layer width: path | path; a pad name or v marks a point on that pad's centre or on a via)
3.3V  (via drill 0.3, 0.46)
  Top 0.305: 91.44,15.08 OK2.+ OK3.+ OK5.+ OK4.+ OK6.+
  Top 0.406: U6.2 26.43,60.56 C18.2 v26.67,59.79 | U7.2 98.81,54.83 | 98.81,54.83 98.81,53.31 | R49.2 98.81,53.31 | 91.44,15.08 95.76,15.08 96.52,15.84 96.52,16.48 | 96.52,16.48 96.52,24.23 97.03,24.73 97.54,24.73 99.06,26.26 99.06,28.8 98.81,29.05 98.81,38.96 99.32,39.47 99.32,52.8 98.81,53.31 | 50.55,57.5 58.42,57.5 60.07,59.15 BG2.+ 97.03,60.04 98.81,58.26 98.81,54.83 | 50.55,57.5 50.04,56.99 50.04,55.98 | 50.55,57.5 50.55,59.91 BG1.+ | 50.04,55.98 v50.04,50.64 | 96.52,16.48 J1.2 J2.3 | v48.26,55.98 50.04,55.98 | v26.67,65.88 27.43,66.64 U$11.2
  Bottom 0.254: U5.9 48.79,43.53 | U$27.P8 57.66,51.37 57.66,50.13 57.41,49.88 56.39,49.88 55.63,49.12 55.37,49.12 54.61,49.12 54.1,48.61 54.1,46.58 51.06,43.53 48.79,43.53 | U5.6 46.69,42.98 47.25,43.53 48.79,43.53
  Bottom 0.406: v26.67,59.79 v26.67,65.88 | v50.04,50.64 51.56,49.12 55.37,49.12 | v48.26,55.98 48.26,59.79 45.72,62.33 45.72,66.39 45.98,66.64 U$11.2 48.03,66.87 U$5.1 47.57,72.09 C8.+
3.7V  (via drill 0.3)
  Top 0.254: v18.29,32.1 18.29,31.34 18.8,30.83 23.62,30.83 23.88,31.08 R64.2 | U6.3 23.5,63.22 23.88,63.6 28.7,63.6 29.21,63.09 R63.1
  Top 0.61: SW1.CH2B SW1.CH1B | U6.3 23.41,62.58 v21.59,62.58 21.51,62.66 U4.3 16.85,62.66 C22.2 14.1,62.33 C21.2
  Bottom 0.254: 16.26,34.13 v18.29,32.1 | 17.53,62.66 17.61,62.58 v18.04,62.58
  Bottom 0.61: SW1.CH1B 11.94,29.81 16.26,34.13 16.26,61.39 17.53,62.66 21.51,62.66 v21.59,62.58
ADC1  (via drill 0.3)
  Top 0.305: v19.05,75.79 20.07,75.79 21.34,74.52 v25.91,74.52 | v32.51,57.5 33.78,56.23 33.78,51.66 35.31,50.13 35.31,45.31 35.82,44.8 v70.36,44.8 | U10.4 85.4,28.24 83.06,30.58 v83.06,31.08
  Bottom 0.254: R1.1 C1.1
  Bottom 0.305: C1.1 18.92,75.66 v19.05,75.79 | v25.91,74.52 29.47,74.52 32.51,71.47 v32.51,57.5 | v70.36,44.8 71.12,44.04 71.12,43.53 83.06,31.59 v83.06,31.08
ADC2  (via drill 0.3)
  Top 0.305: v21.59,75.79 v27.43,75.79 | v33.53,58.52 33.53,57.5 34.55,56.48 34.55,52.17 36.07,50.64 36.07,46.07 36.58,45.56 71.12,45.56 71.63,45.05 v71.63,44.8 | U10.5 86.2,29.22 v84.33,31.08
  Bottom 0.254: R2.1 C2.1
  Bottom 0.305: C2.1 21.46,75.66 v21.59,75.79 | v27.43,75.79 29.47,75.79 33.28,71.98 33.28,58.77 v33.53,58.52 | v71.63,44.8 71.88,44.55 71.88,43.78 84.33,31.34 v84.33,31.08
ADC3  (via drill 0.3)
  Top 0.305: v83.82,76.55 v83.82,72.99 | U10.7 87.8,25.33 86.87,26.26 86.87,31.34 v86.11,32.1
  Bottom 0.254: R3.1 v83.82,76.55
  Bottom 0.305: C3.1 v83.82,76.55 | v83.82,72.99 84.84,72.99 86.36,71.47 86.36,32.35 v86.11,32.1
ADC4  (via drill 0.3)
  Top 0.305: U10.8 88.6,25.5 87.63,26.46 87.63,32.1 v87.38,32.35 | v88.9,76.55 88.14,76.55 87.12,77.57 85.85,77.57 85.35,77.06 85.35,74.01 v86.36,72.99
  Bottom 0.254: R4.1 v88.9,76.55
  Bottom 0.305: C4.1 v88.9,76.55 | v86.36,72.99 87.12,72.23 87.12,32.61 v87.38,32.35
ADC5  (via drill 0.3)
  Top 0.305: U10.9 89.4,26 88.39,27.01 88.39,32.61 v88.65,32.86 | v86.36,76.55 86.36,74.52 v87.89,72.99
  Bottom 0.254: R9.1 v86.36,76.55
  Bottom 0.305: C11.1 v86.36,76.55 | v87.89,72.99 87.89,33.62 v88.65,32.86
ADC6  (via drill 0.3)
  Top 0.305: v34.55,59.53 34.55,57.5 35.31,56.74 35.31,52.67 36.83,51.15 36.83,46.83 37.34,46.32 71.88,46.32 v72.65,45.56 | U10.10 90.2,26.23 89.16,27.27 89.16,31.59 v89.41,31.85
  Bottom 0.254: R16.1 C15.1
  Bottom 0.305: C15.1 25.27,75.66 26.16,76.55 30.23,76.55 34.04,72.74 34.04,60.04 v34.55,59.53 | v72.65,45.56 72.9,45.31 72.9,43.78 85.85,30.83 88.39,30.83 v89.41,31.85
ADC7  (via drill 0.3)
  Top 0.305: U10.12 94.17,25.81 v95.51,24.48
  Bottom 0.305: v95.51,24.48 101.35,24.48 102.62,23.21 102.62,20.67 J2.2
ADCV  (via drill 0.3)
  Top 0.305: R63.2 R43.2 31.12,57.5 33.02,55.6 33.02,51.15 34.55,49.63 34.55,44.55 35.05,44.04 69.6,44.04 v70.11,43.53 | v90.17,30.83 90.17,27.53 91,26.7 U10.11 91.85,23.61 v91.95,23.72
  Bottom 0.305: v70.11,43.53 81.79,31.85 81.79,30.58 82.3,30.07 89.41,30.07 v90.17,30.83 | J2.1 100.97,23.08 100.59,23.46 95,23.46 94.74,23.72 v91.95,23.72
BAT  (via drill 0.3)
  Top 0.406: BAT1.1 6.99,18.77 7.62,18.13 18.8,18.13 20.45,19.78 U2.5
  Top 0.61: SW1.CH2A SW1.CH1A SW1.COM1 | SW1.CH2A 6.99,24.35 BAT1.1 | SW1.COM2 SW1.CH2A
  Top 0.813: DC2.+ DC1.+ 19.54,78.81 v8.89,68.17 v8.89,66.9 v8.89,65.63
  Bottom 0.61: 8.89,27.27 SW1.COM1
  Bottom 0.813: v8.89,68.17 8.89,44.8 9.91,43.78 11.18,43.78 14.99,39.97 14.99,34.89 11.94,31.85 9.65,31.85 8.89,31.08 8.89,27.27 SW1.COM2
CE  (via drill 0.3)
  Top 0.305: U10.30 85.4,40.94 84.33,42.01 v84.33,47.09 | U$5.2 49.73,68.98 50.29,68.42 57.66,68.42 58.93,67.15 v58.93,64.61
  Bottom 0.254: 49.73,68.12 49.53,67.91 49.53,65.37 U$11.3
  Bottom 0.305: v58.93,64.61 59.18,64.36 65.79,64.36 69.09,61.06 72.39,61.06 74.68,58.77 74.68,53.44 75.19,52.93 77.73,52.93 80.77,49.88 81.54,49.88 v84.33,47.09 | 49.73,68.12 U$5.2
CHRG2
  Top 0.254: U2.7 22.86,23.46 23.5,24.1 R15.1
FMQ
  Top 0.305: R55.1 97.28,51.66 98.3,50.64 98.3,39.97 98.05,39.72 98.05,28.54 98.3,28.29 98.3,26.51 97.28,25.5 95.51,25.5 94.39,26.61 U10.13
GND  (via drill 0.3)
  Top 0.254: U3.11 40.79,84.66 C6.1 C10.2 39.5,83.54 39.12,83.15 37.09,83.15 37.09,85.44 37.34,85.69 39.37,85.69 39.75,86.07 U3.9 | U2.1 15.88,24.73 U2.9 17.53,22.58 17.53,22.19 U2.3 14.23,22.19 13.46,21.43 R13.1 10.67,21.43 BAT1.2 | U6.1 22.55,61 23.12,61.56 24.89,61.56 25.66,62.33 C18.1 | WS2.P$2 80.67,46.48 81.89,47.7 WS3.P$2 | WS3.P$2 WS4.P$2 v89.92,48.86 | WS1.P$2 81.89,52.72 WS3.P$2
  Top 0.305: U10.16 95.72,29.01 96.27,29.56 96.27,38.96 v95,40.23 95,41.75 C17.1
  Top 0.406: DC2.- 95.78,11.3 J1.1 J2.4
  Bottom 0.254: Y1.H3 14.99,75.53 16.38,74.14 C1.2 C2.2 C15.2 | C3.2 C11.2 C4.2 90.49,72.55 Y2.MOUNT4 | R22.1 62.23,47.59 63.18,47.59 | 63.18,47.59 63.98,47.59 | 64.14,47.59 64.77,47.59 | C26.1 64.14,47.59 | 64.14,47.59 63.98,47.59 | 63.98,47.59 U$27.P16 63.98,53.98 63.76,54.2 62.49,54.2 62.23,53.94 62.23,53.44 61.72,52.93 60.2,52.93 60.01,52.74 U$27.P11 | U$27.P17 64.77,47.59 | 64.77,47.59 66.04,47.59 C25.1 66.93,46.45 67.31,46.07 67.31,42.51 66.11,41.31 U5.30 U5.29 | U$27.P15 63.18,47.59 | C20.2 R19.2 | v89.92,48.86 90.93,47.85 90.93,45.05 91.19,44.8 91.19,41.24 92.2,40.23 v95,40.23
  other vias: 12.7,19.91 22.35,24.73 26.42,27.27 12.7,24.73 17.78,19.65 17.53,28.54 32.01,33.12 32.01,30.58 23.12,32.1 23.12,35.4 31.75,38.96 32.77,39.97 30.23,42.26 20.83,42.01 22.35,46.32 11.69,47.85 7.11,47.85 10.42,56.99 22.35,53.94 17.53,59.28 13.97,59.28 22.61,59.28 29.97,59.28 19.05,72.99 21.59,72.99 24.89,80.87 14.73,79.34 37.59,92.04 36.32,88.74 43.94,90.77 41.91,96.87 60.45,65.63 60.45,67.15 52.58,58.77 51.06,53.18 56.9,53.18 59.95,55.98 55.12,56.48 57.15,56.48 48.52,53.18 55.12,36.93 82.04,51.4 84.58,51.4 92.2,54.71 91.19,47.09 91.44,39.97 100.33,53.94 96.27,34.39 99.82,34.13 100.33,25.75 79.76,21.18 78.23,23.21 93.47,19.91 76.2,58.52 15.24,41.24 17.27,40.99 22.35,50.64 10.67,54.45 19.05,35.15
  pour Bottom: -0.14,106.07 106.86,106.07 106.86,0.07 -0.14,0.07
  pour Top: -0.14,106.07 106.86,106.07 106.86,0.07 -0.14,0.07
IRQ  (via drill 0.3)
  Top 0.305: U10.20 94.6,32.21 95,32.61 95,35.66 92.46,38.2 v89.66,38.2 | v85.09,46.07 85.6,46.58 v88.9,46.58
  Bottom 0.254: U$5.7 58.24,67.23 57.66,66.64
  Bottom 0.305: U$11.8 57.66,66.64 57.66,64.1 58.17,63.6 65.53,63.6 68.84,60.29 72.14,60.29 73.92,58.52 73.92,52.93 74.68,52.17 77.47,52.17 80.52,49.12 81.03,49.12 84.08,46.07 v85.09,46.07 | v88.9,46.58 88.9,38.96 v89.66,38.2
LCD_A0  (via drill 0.3)
  Top 0.305: U10.38 78.7,30.61 76.46,32.86 76.46,44.04 77.34,44.93 77.34,46.45 78.23,47.34 78.23,50.39 77.47,51.15 73.15,51.15 72.39,50.39 60.96,50.39 v60.2,49.63
  Bottom 0.254: SJ3.1 58.17,48.1 59.69,49.63 v60.2,49.63 60.8,50.23 U$27.P12
LCD_BG  (via drill 0.3)
  Top 0.305: v58.68,54.45 60.2,54.45 60.71,54.96 67.57,54.96 68.84,53.69 v68.84,52.42 | U10.25 89.4,34.63 88.39,33.62 85.09,33.62 v84.84,33.37
  Bottom 0.305: R25.1 v58.68,54.45 | v68.84,52.42 68.84,51.66 72.14,48.36 73.66,48.36 80.52,41.5 80.52,38.45 84.84,34.13 v84.84,33.37
LCD_CS  (via drill 0.3)
  Top 0.305: U10.35 79.61,33.01 78.74,33.88 78.74,38.7 79.5,39.47 v79.5,39.72 | v62.99,53.18 v66.8,53.18
  Bottom 0.254: SJ1.1 61.72,48.1 62.39,48.77 U$27.P14 62.39,52.83 62.74,53.18 v62.99,53.18
  Bottom 0.305: v79.5,39.72 79.76,39.97 79.76,41.24 73.41,47.59 71.63,47.59 66.8,52.42 v66.8,53.18
LCD_RST  (via drill 0.3)
  Top 0.305: U10.40 79.29,29.01 75.69,32.61 75.69,44.29 76.71,45.31 76.71,46.83 77.47,47.59 77.47,49.88 76.96,50.39 73.41,50.39 72.65,49.63 61.72,49.63 v61.47,49.37
  Bottom 0.254: SJ2.1 59.06,48.23 59.69,48.86 60.96,48.86 v61.47,49.37 61.6,49.5 U$27.P13
LCD_SCK  (via drill 0.3)
  Top 0.305: U10.37 78.92,31.41 77.22,33.12 77.22,43.78 78.11,44.67 78.11,46.2 79,47.09 79,50.9 77.98,51.91 72.9,51.91 72.14,51.15 68.58,51.15 67.82,51.91 67.82,53.69 67.31,54.2 61.47,54.2 v61.22,53.94
  Bottom 0.254: SJ4.1 56.52,48.48 56.9,48.86 58.17,48.86 59.18,49.88 59.18,51.37 U$27.P10 59.22,52.71 59.95,53.44 60.71,53.44 v61.22,53.94
LCD_SDA  (via drill 0.3)
  Top 0.305: U10.36 79.39,32.21 77.98,33.62 77.98,39.72 v78.74,40.48
  Bottom 0.254: U$27.P9 58.42,49.88 57.91,49.37 56.64,49.37 55.37,48.1 SJ5.1
  Bottom 0.305: v78.74,40.48 78.74,41.24 73.41,46.58 71.12,46.58 65.79,51.91 65.79,53.44 64.26,54.96 60.71,54.96 58.42,52.67 U$27.P9
LED1
  Top 0.254: U10.1 83,22.39 81.28,20.67 R27.1
LED2
  Top 0.254: U10.2 83.8,19.81 R24.1
LED3
  Top 0.254: U10.3 84.6,22.44 86.36,20.67 R26.1
LED4
  Top 0.254: U10.17 91.95,29.81 91.44,29.31 91.44,27.53 91.7,27.27 91.7,25.24 91.95,24.99 92.2,24.99 92.97,24.23 92.97,22.96
  Top 0.305: 92.97,22.96 91.95,21.94 89.92,21.94 88.9,20.92 R23.1
LED5  (via drill 0.3)
  Top 0.305: U10.15 95.58,28.21 v96.52,27.27 | v93.73,24.73 93.73,22.7 91.44,20.42 R42.1
  Bottom 0.254: 93.85,25.12 93.73,24.99 v93.73,24.73
  Bottom 0.305: v96.52,27.27 96.01,27.27 93.85,25.12
MISO  (via drill 0.3)
  Top 0.305: U10.32 83.8,39.49 83.31,39.97 83.31,45.31 v83.06,45.56
  Bottom 0.254: U$5.6 56.54,69.84 54.61,67.91 54.61,65.88 55.88,64.61 U$11.7
  Bottom 0.305: U$11.7 57.15,62.83 65.28,62.83 68.58,59.53 71.88,59.53 73.15,58.26 73.15,52.42 74.17,51.4 77.22,51.4 80.27,48.36 80.77,48.36 83.06,46.07 v83.06,45.56
MOSI  (via drill 0.3)
  Top 0.305: U10.33 83,39.28 82.55,39.72 82.55,44.8 v81.79,45.56
  Bottom 0.254: U$5.5 54.84,69.41 53.34,67.91 U$11.6 53.34,66.14 54.61,64.87 54.61,62.83
  Bottom 0.305: v81.79,45.56 81.79,46.32 80.52,47.59 80.01,47.59 76.96,50.64 73.66,50.64 72.39,51.91 72.39,53.18 69.34,56.23 69.34,57.75 65.03,62.07 55.37,62.07 54.61,62.83
N$1
  Bottom 0.254: Y1.H2 16,78.07 16.77,78.84 R1.2
N$2
  Bottom 0.254: Y2.H2 82.04,78.07 82.81,78.84 R3.2
N$3
  Bottom 0.254: R4.2 88.9,81.63 83.82,86.71 Y2.V2
N$4
  Bottom 0.254: Y1.V2 22.86,82.39 20.32,79.85 R2.2
N$5  (via drill 0.3)
  Top 0.254: v86.36,81.88 v86.36,85.44
  Bottom 0.254: R9.2 v86.36,81.88 | v86.36,85.44 88.65,87.73 88.65,89.5 87.12,91.03 81.92,91.03 | 81.92,91.03 80.77,91.03 80.01,91.79 U$23.3 | U$23.2 81.92,91.03
N$6
  Bottom 0.254: U$8.2 28.58,90.14 27.69,89.25 | 27.69,89.25 27.69,87.98 23.62,83.92 23.62,82.14 22.86,81.38 R16.2 | U$8.3 26.67,90.27 27.69,89.25
N$7
  Bottom 0.254: U$27.P1 C16.1
N$8
  Bottom 0.254: U$27.P2 52.87,55.18 C16.2
N$9
  Bottom 0.254: U$27.P3 53.66,54.26 C19.1
N$10
  Bottom 0.254: U$27.P4 54.45,53.28 54.61,53.44 54.61,55.21 C19.2
N$11
  Bottom 0.254: U$27.P6 56.04,54.45 | 56.04,54.45 R19.1 | 56.04,54.45 C20.1
N$12
  Top 0.254: OK3.- R23.2
N$13
  Top 0.254: R24.2 OK4.-
N$14
  Bottom 0.254: U5.26 60.69,43.39 R22.2
N$15
  Top 0.254: R15.2 27.05,24.1 27.43,24.48 27.43,28.29 28.32,29.18 CH1.-
N$16
  Top 0.254: U3.10 40.28,85.85 39.63,85.19 38.36,85.19 37.97,84.81 C10.1
N$17
  Top 0.254: U3.20 40.79,92.7 C5.1
N$18
  Bottom 0.254: U5.2 43.89,44.85 C23.2
N$19
  Bottom 0.254: U5.3 44.59,42.91 44.71,43.02 44.71,45.56 C23.1
N$20
  Top 0.305: R27.2 OK6.-
N$21
  Top 1.016: ANT2.SIG 53.34,91.79 52.33,90.77 JP1.1
N$22
  Top 0.254: U2.2 13.21,23.46 R13.2
N$23  (via drill 0.3)
  Top 0.406: U7.1 85.22,56.87 v85.09,56.99 | v81.03,76.3 65.86,91.46 SP1.+
  Bottom 0.406: v85.09,56.99 85.09,70.2 84.08,71.22 83.31,71.22 81.03,73.5 v81.03,76.3
N$24
  Bottom 0.254: U5.4 45.29,45.39 C24.2
N$25
  Bottom 0.254: U5.5 45.99,44.56 C24.1
N$26
  Top 0.254: R42.2 OK2.-
N$27
  Bottom 0.254: U5.28 62.09,42.88 62.74,43.53 64.64,43.53 C25.2
N$28  (via drill 0.3)
  Top 0.254: U1.2 18.92,39.34 v19.05,39.47 | v24,40.61 D3.-
  Bottom 0.254: v19.05,39.47 22.86,39.47 v24,40.61
N$29
  Bottom 0.254: U5.27 61.39,42.94 62.49,44.04 63.25,44.04 C26.2
N$30  (via drill 0.3)
  Top 0.254: BG1.- 47.88,61.18 48.26,61.56 51.82,61.56 53.34,60.04 BG2.-
  Top 0.305: BG2.- 57.41,59.91 v57.41,58.52
  Bottom 0.305: R25.2 58.55,57.37 v57.41,58.52
N$31
  Top 0.254: R26.2 OK5.-
N$38
  Top 0.254: R10.1 26.8,32.99 28.07,34.26 TXD.+
N$39
  Top 0.254: R55.2 R49.1 95.12,54.6 U7.3
N$41
  Top 0.254: R11.1 27.18,34.89 27.69,35.4 27.69,36.42 28.07,36.8 RXD.+
N$42
  Top 0.254: C13.2 24.55,29.9 24.39,30.07 15.75,30.07 | 15.75,30.07 14.86,30.07 X1.1 | U1.8 15.85,30.17 15.75,30.07
N$43
  Top 0.254: U1.7 13.84,32.99 12.96,32.1 12.96,27.78 13.46,27.27 X1.2 20.83,27.27 22.1,26 C12.2
N$47
  Top 0.406: J3.P1 13.01,38.76 13.21,38.96 13.21,40.99 12.45,41.75 11.69,41.75 10.92,42.51 F1.2
N$48  (via drill 0.3)
  Top 0.254: U1.4 18.92,36.8 v19.05,36.67 | v24.51,36.8 C14.2
  Bottom 0.254: v19.05,36.67 24.39,36.67 v24.51,36.8
N$53  (via drill 0.3)
  Top 0.254: U1.3 18.92,38.07 v19.05,38.2
  Bottom 0.254: v19.05,38.2 24.13,38.2 R12.2
  other vias: 24.64,38.7
N$54  (via drill 0.3)
  Top 0.254: v13.72,37.94 13.57,38.09 J3.P2 | U1.6 14.35,34.26 v13.46,35.15
  Bottom 0.254: v13.72,37.94 13.46,37.69 v13.46,35.15
N$55
  Top 0.254: J3.P3 12.96,37.43 13.46,36.93 13.46,36.42 14.35,35.53 U1.5
N$65
  Top 0.254: R64.1 26.93,31.08 27.56,31.72 LED.+
N$321
  Top 0.254: R14.2 27.18,22.19 28.96,23.97 OK1.-
OLED_CS
  Bottom 0.254: U5.13 51.59,43.05 55.25,46.71 SJ5.2
OLED_DC
  Bottom 0.254: U5.15 52.99,42.67 54.1,43.78 57.41,43.78 57.79,44.17 SJ3.2
OLED_RES
  Bottom 0.254: U5.14 52.29,42.73 54.1,44.55 SJ4.2
OLED_SCLK
  Bottom 0.254: U5.18 55.09,42.99 55.37,43.28 58.42,43.28 59.06,43.91 SJ2.2
OLED_SDIN
  Bottom 0.254: U5.19 55.79,42.68 55.88,42.77 59.18,42.77 60.33,43.91 SJ1.2
RXD1  (via drill 0.3)
  Top 0.305: D3.+ 27.31,40.61 27.69,40.23 27.69,39.47 28.2,38.96 30.23,38.96 30.74,38.45 RXD.- 31.37,36.8 34.8,40.23 66.04,40.23 67.31,38.96 v67.31,35.91 | U10.18 94.96,30.61 v95.25,30.32
  Bottom 0.305: v67.31,35.91 71.63,35.91 76.96,30.32 76.96,27.78 79.25,25.5 92.2,25.5 95.25,28.54 v95.25,30.32
RXD2  (via drill 0.3)
  Top 0.305: U10.39 82.3,29.81 82.81,29.31 82.81,25.5 80.65,23.34 v80.65,22.83
  Bottom 0.305: v80.65,22.83 94.36,22.83 94.74,22.45 97.54,22.45 J1.4
SCL  (via drill 0.3)
  Top 0.254: U3.23 39.24,93.06 39.88,93.7 v39.88,93.82
  Top 0.305: R35.2 v39.88,93.82 | v37.59,60.29 37.59,53.69 39.12,52.17 39.12,49.12 39.63,48.61 72.9,48.61 75.19,46.32 75.19,44.8 74.93,44.55 74.93,32.35 79.07,28.21 U10.41
  Bottom 0.305: v39.88,93.82 38.1,93.82 33.53,89.25 33.53,77.57 36.32,74.77 36.32,61.56 v37.59,60.29
SCLK  (via drill 0.3)
  Top 0.305: U10.31 84.6,40.22 v84.33,40.48
  Bottom 0.254: U$5.4 53.14,68.98 52.07,67.91 52.07,65.88 53.34,64.61 U$11.5
  Bottom 0.305: U$11.5 53.34,62.58 54.61,61.31 64.77,61.31 68.58,57.5 68.58,55.98 71.63,52.93 71.63,51.4 73.15,49.88 76.71,49.88 79.76,46.83 80.01,46.83 80.52,46.32 80.52,44.29 v84.33,40.48
SCN  (via drill 0.3)
  Top 0.305: U10.34 80.73,33.88 80.01,33.88 80.01,38.2 80.52,38.7 80.52,40.99 79,42.51 79,45.31 v79.5,45.82
  Bottom 0.254: U$5.3 51.44,67.28 U$11.4 50.8,66.14 52.07,64.87 52.07,62.83
  Bottom 0.305: v79.5,45.82 76.2,49.12 72.65,49.12 70.87,50.9 70.87,52.67 67.82,55.72 67.82,57.25 64.52,60.55 54.36,60.55 52.07,62.83
SDA  (via drill 0.3)
  Top 0.254: U3.24 38.74,93.18 R30.2
  Top 0.305: R30.2 v36.83,93.82 | v36.58,59.53 36.58,57.75 36.83,57.5 36.83,53.44 38.36,51.91 38.36,48.1 38.61,47.85 72.65,47.85 74.42,46.07 74.42,45.05 74.17,44.8 74.17,32.1 78.86,27.41 U10.42
  Bottom 0.305: v36.83,93.82 32.77,89.76 32.77,77.31 35.56,74.52 35.56,61.06 36.58,60.04 v36.58,59.53
STCV  (via drill 0.3, 0.46)
  Top 0.254: U3.8 39.24,86.58 38.86,86.2 37.34,86.2 v37.09,86.46 35.31,88.23 35.31,95.35 | U3.13 42.45,88.21 42.67,87.98 v42.67,85.69 C6.2 42.67,83.15 42.93,82.9 72.14,82.9 73.66,81.38 Y2.H1 | 35.31,95.35 R30.1 R35.1 | 35.31,95.35 25.66,95.35 24.77,94.46 U$8.4
  Top 0.305: R29.1 R31.1 R21.1 R20.1 8.76,55.09 9.4,55.72 16,55.72 19.81,59.53 v20.58,59.53
  Top 0.406: v20.58,59.53 20.58,60.5 U4.2 | 97.54,42.01 C17.2 | R6.1 97.54,43.78 | 97.54,43.78 97.54,42.01 | R7.1 97.54,45.69 | 97.54,45.69 97.54,43.78 | R8.1 97.54,47.59 | 97.54,47.59 97.54,45.69 | 97.54,47.59 97.54,49.5 R5.1 96.65,50.26 96.27,50.64 94.49,50.64 92.46,52.67 v90.17,52.67 | 97.54,42.01 97.28,41.75 97.28,28.04 97.54,27.78 97.54,26.77 97.03,26.26 95.76,26.26 94.6,27.41 U10.14 | v90.17,61.56 53.34,61.56 52.58,62.33 46.48,62.33 44.34,64.47 C9.+ 43.07,64.36 v23.37,64.36
  Bottom 0.254: U$8.4 24.77,91.66 23.88,90.77 | 23.88,90.77 22.86,91.79 U$8.5 | 23.88,90.77 20.83,90.77 20.32,90.27 Y1.V1 20.32,81.63 19.81,81.12 R17.1 18.54,80.61 13.21,80.61 Y1.H1 | v37.09,86.46 37.85,85.69 v42.67,85.69 | Y2.H1 83.31,80.61 R18.1 84.58,81.12 84.84,81.38 84.84,83.92 81.28,87.47 Y2.V1 U$23.5 U$23.4
  Bottom 0.406: 13.21,80.61 10.42,80.61 9.4,79.6 9.4,71.98 17.02,64.36 v23.37,64.36 23.37,62.33 v20.58,59.53 | v90.17,52.67 v90.17,61.56
STDBY2
  Top 0.254: U2.6 R14.1
TXD1  (via drill 0.3)
  Top 0.305: R12.1 26.93,38.7 v27.43,38.2 | TXD.- 31.37,34.26 v31.75,34.64 31.75,36.16 35.05,39.47 65.03,39.47 v66.04,38.45 | v95.25,31.59 95.07,31.41 U10.19
  Bottom 0.305: v27.43,38.2 30.99,34.64 v31.75,34.64 | v95.25,31.59 95,31.59 94.24,30.83 94.24,28.54 91.95,26.26 79.76,26.26 77.98,28.04 77.98,30.58 71.88,36.67 68.07,36.67 66.3,38.45 v66.04,38.45
TXD2  (via drill 0.3)
  Top 0.305: U10.6 87,21.81 v87.12,21.69
  Bottom 0.305: v87.12,21.69 95.76,21.69 J1.3
USBV  (via drill 0.3, 0.46)
  Top 0.254: OK1.+ CH1.+ 30.74,30.32 27.69,30.32 v27.43,30.07 | R11.2 v24.64,33.88 R10.2
  Top 0.406: F1.1 8.13,44.8 8.64,45.31 11.69,45.31 14.73,42.26 v18.04,42.26 19.69,40.61 U1.16 22.23,40.61 23.62,42.01 28.7,42.01 28.96,41.75 C7.2 | v20.58,26 20.45,25.88 U2.8 | U2.4 v15.11,19.91
  Bottom 0.254: v24.64,33.88 23.37,33.88 20.58,31.08 | v27.43,30.07 20.58,30.07
  Bottom 0.406: v15.11,19.91 15.11,25.37 15.75,26 v20.58,26 20.58,30.07 20.58,31.08 20.58,32.35 18.04,34.89 18.04,40.23 18.29,40.48 18.29,42.01 v18.04,42.26
WS1  (via drill 0.3)
  Top 0.254: R5.2 94.36,49.5 93.22,50.64 v92.2,50.64 87.63,50.64 86.87,51.4 86.87,53.84 WS1.P$1
  Top 0.305: U10.26 88.6,40.69 89.41,41.5 v92.2,41.5
  Bottom 0.305: v92.2,41.5 v92.2,50.64
WS2
  Top 0.254: R6.2 WS2.P$1
  Top 0.305: U10.28 87,43.76 WS2.P$1
WS3  (via drill 0.3)
  Top 0.254: R7.2 94.11,45.69 v93.35,44.93
  Top 0.305: v93.47,42.51 88.9,42.51 87.8,41.41 U10.27 87.8,34.81 87.38,34.39 82.55,34.39 81.79,35.15 v81.79,38.96 | WS3.P$1 75.95,48.51 v75.95,47.59
  Bottom 0.254: v93.35,44.93 93.47,44.8 v93.47,42.51
  Bottom 0.305: v75.95,47.59 75.95,47.09 81.28,41.75 81.28,39.47 v81.79,38.96
WS4
  Top 0.254: 93.22,47.59 R8.2 93.32,47.59 WS4.P$1
  Top 0.305: U10.29 86.2,41.66 85.09,42.77 85.09,44.8 85.85,45.56 91.19,45.56 93.22,47.59
WSA  (via drill 0.3)
  Top 0.254: R20.2 12.96,52.67 13.36,53.08 WSA.P$1
  Top 0.305: WSA.P$1 15.75,53.94 v18.04,56.23 | v18.04,49.37 31.5,49.37 33.02,47.85 33.02,43.53 34.04,42.51 67.57,42.51 v70.36,39.72 | v91.19,32.86 91.34,33.01 U10.21
  Bottom 0.305: v18.04,56.23 v18.04,49.37 | v70.36,39.72 71.12,38.96 72.65,38.96 80.27,31.34 80.27,29.56 81.28,28.54 90.68,28.54 91.95,29.81 91.95,32.61 91.7,32.86 v91.19,32.86
WSB  (via drill 0.3)
  Top 0.254: R21.2 12.32,50.77 13.72,52.17 30.74,52.17 | 31.24,51.66 31.24,53.79 WSB.P$1
  Top 0.305: 30.74,52.17 31.24,51.66 33.78,49.12 33.78,44.04 34.55,43.28 68.58,43.28 v71.38,40.48 | v89.92,33.62 90.11,33.81 U10.22
  Bottom 0.305: v71.38,40.48 72.14,39.72 72.9,39.72 81.03,31.59 81.03,30.07 81.79,29.31 90.43,29.31 91.19,30.07 91.19,31.34 89.92,32.61 v89.92,33.62
WSC  (via drill 0.3)
  Top 0.254: R29.2 11.05,46.96 11.69,46.32 WSC.P$1
  Top 0.305: WSC.P$1 13.36,44.9 14.99,43.28 30.74,43.28 33.02,40.99 66.3,40.99 68.33,38.96 v68.33,37.94 | U10.23 91.04,36.01 91.19,36.16 v92.97,36.16
  Bottom 0.305: v68.33,37.94 68.84,37.43 72.14,37.43 78.74,30.83 78.74,28.54 80.27,27.02 91.44,27.02 93.47,29.05 93.47,35.66 v92.97,36.16
WSD  (via drill 0.3)
  Top 0.254: R31.2 12.96,48.86 13.72,48.1 30.48,48.1 30.99,47.59 30.99,46.43 WSD.P$1
  Top 0.305: WSD.P$1 31.09,44.19 33.53,41.75 66.8,41.75 69.34,39.21 v69.34,38.96 | U10.24 90.2,34.87 90.43,34.64 91.7,34.64 v92.2,35.15
  Bottom 0.305: v69.34,38.96 70.11,38.2 72.39,38.2 79.5,31.08 79.5,29.05 80.77,27.78 90.93,27.78 92.71,29.56 92.71,34.64 v92.2,35.15
WSL  (via drill 0.3)
  Top 0.305: v19.05,83.41 v24.89,83.41 | v35.56,58.52 35.56,57.5 36.07,56.99 36.07,53.18 37.59,51.66 37.59,47.59 38.1,47.09 72.39,47.09 73.66,45.82 73.66,45.31 73.41,45.05 73.41,31.85 76.71,28.54 76.71,28.04 75.69,27.02 75.69,25.75 76.2,25.24 76.96,25.24 77.54,25.81 U10.44
  Bottom 0.254: WSL.2 21.57,100.91 20.32,99.66 20.32,92.04 18.54,90.27 18.54,87.47 19.05,86.96 v19.05,83.41
  Bottom 0.305: R17.2 v19.05,83.41 | v24.89,83.41 25.4,83.41 34.8,74.01 34.8,60.8 35.56,60.04 v35.56,58.52
WSR  (via drill 0.3)
  Top 0.305: v82.3,82.65 82.3,70.71 85.6,67.41 v88.9,67.41 | U10.43 77.07,26.61 v76.71,26.26
  Bottom 0.254: WSR.2 74.91,100.91 73.66,99.66 73.66,93.31 83.82,83.15 R18.2
  Bottom 0.305: R18.2 v82.3,82.65 | v88.9,67.41 88.9,48.1 89.92,47.09 89.92,39.47 92.2,37.18 93.47,37.18 94.24,36.42 94.24,34.39 96.52,32.1 96.52,28.8 92.46,24.73 78.74,24.73 77.22,26.26 v76.71,26.26
(copper drawn outside any net)
  shapes: Top area x1

### Text on the board
Bottom: Crazybird-RC-v1.0 | 2016.12.6
tPlace: L | R | 2.4G | NRF24L01 / +PA | CRAZYBIRD | REMOTE CONTROLLER | A | B | C | D | USB | Micro | ON | LQFP44 | STC-3.3V | OFF | RXD2 | TXD2 | 3.7V/GND | VCC | GND